# EasyEDA Pro project glimmer.epro, board Glimmer
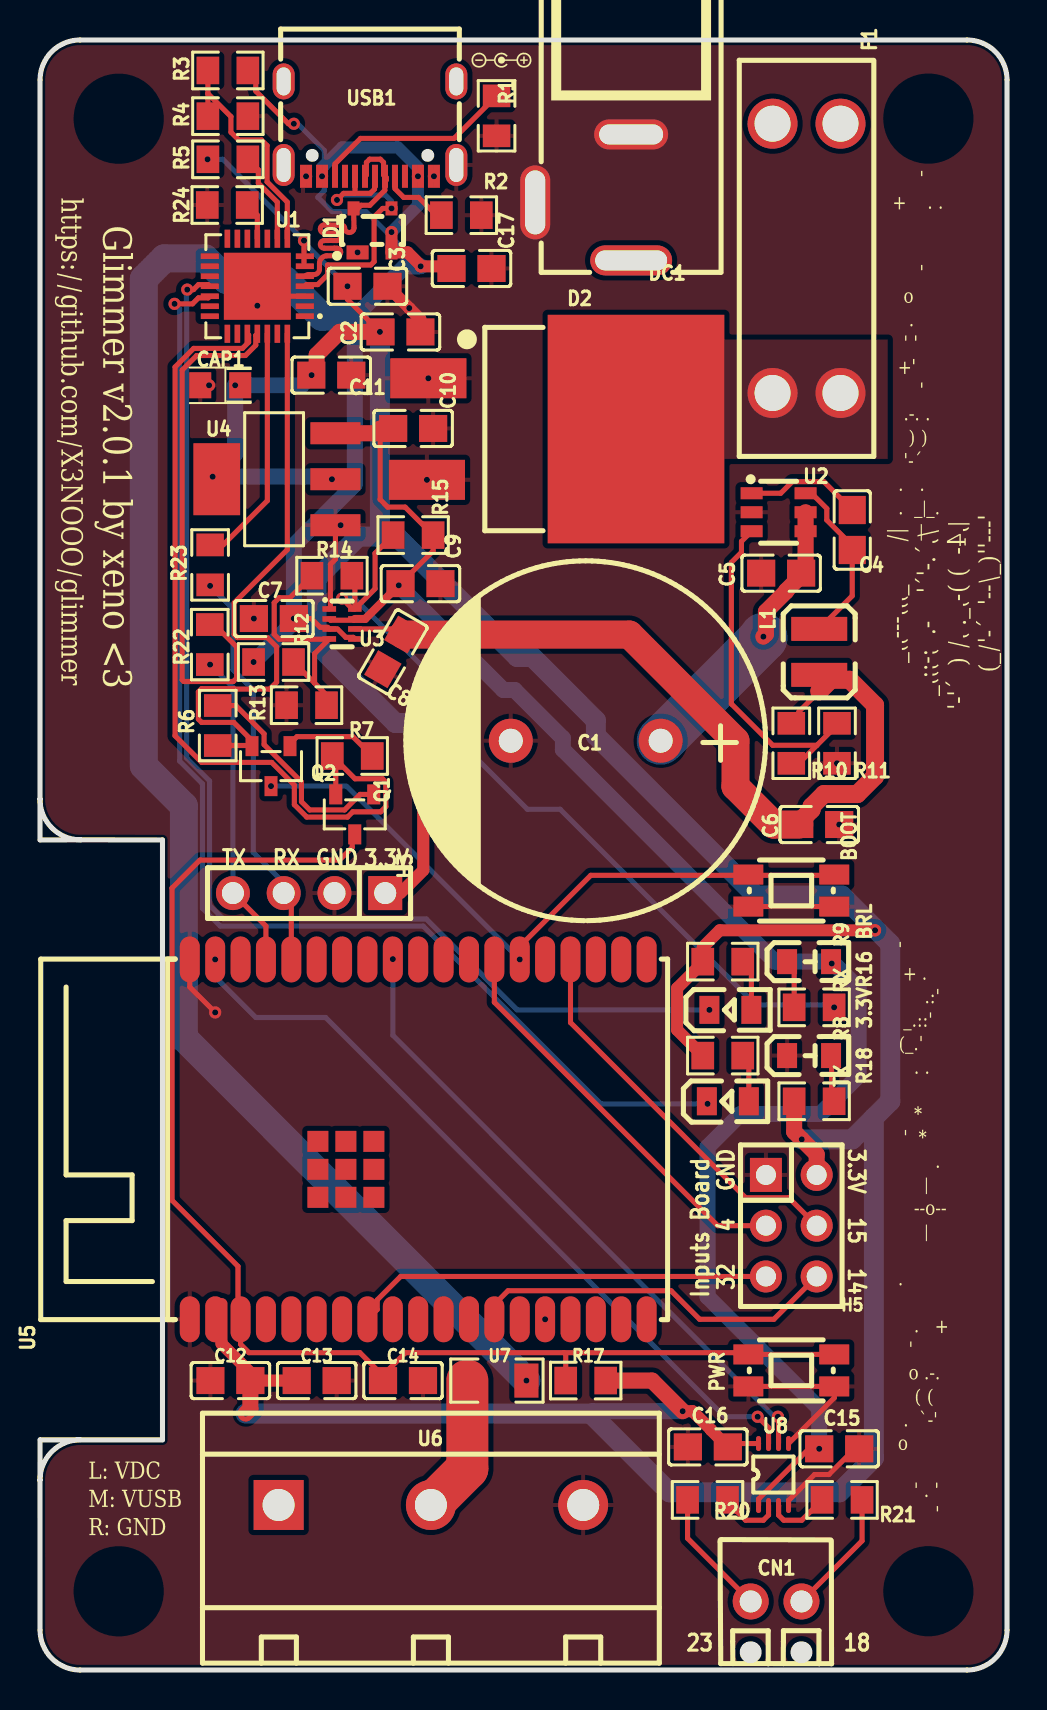
[diagram p4: board, top side]
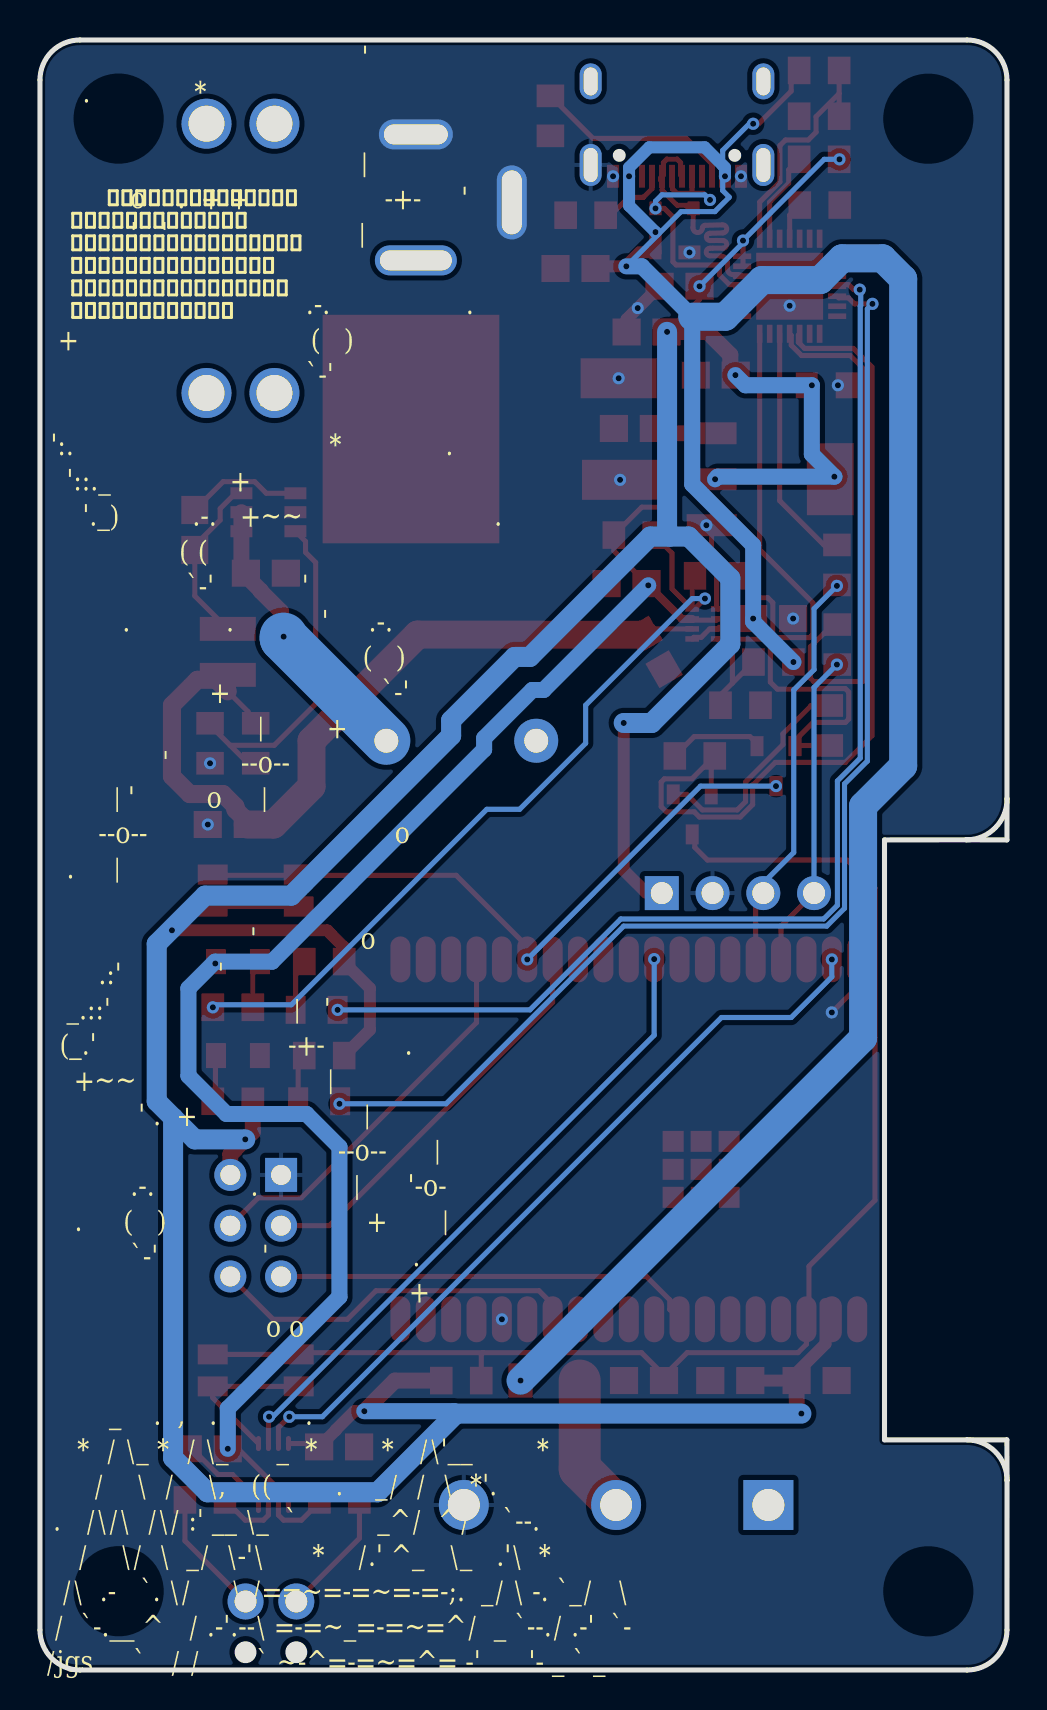
[diagram p5: board, bottom side, seen from below]

Outline 48.39 x 81.53 mm; copper layers: Top Layer, Inner1, Inner2, Bottom Layer. Coordinates in mm from the lower left corner of the outline.
Outline path: 0,9.49 0,2 arc(0.59,0.59) 2,0 46.39,0 arc(47.81,0.59) 48.39,2 48.39,79.53 arc(47.81,80.95) 46.39,81.53 2,81.53 arc(0.59,80.95) 0,79.53 0,43.56 ; 0,9.49 arc(0.59,10.92) 2.02,11.51 ; 0,9.49 0.01,11.51 6.13,11.51 6.13,41.52 2.05,41.53 0,41.52 0,43.58 arc(0.58,42.14) 2.01,41.52
Stack: Top Layer 0.035mm Outer layer thickness 1oz / Dielectric1 0.2104mm 7628 RC49% 8.6mil / Inner1 0.0152mm Inner layer thickness / Dielectric2 1.065mm 1.1mm H/HOZ Copper / Inner2 0.0152mm Inner layer thickness / Dielectric3 0.2104mm 7628 RC49% 8.6mil / Bottom Layer 0.035mm Outer layer thickness 1oz

## Design rules (mm)
net USB_D-: DP1
net USB_D+: DP1
template: JLCPCB Capability(Two Layers Board)
spacing copperThickness1oz (default): track to track 0.102, other pairs 0.152 to 0.3
spacing copperThickness2oz: track to track 0.203, other pairs 0.152 to 0.3
track width copperThickness1oz (default): min 0.127, default 0.254, max 2.54
track width copperThickness2oz: min 0.203, default 0.254, max 2.54
differential pair differentialPair (default): width min 0.127, default 0.254, max 2.54; gap min 0.152, default 0.152
via viaSize (default): diameter min 0.5, default 0.61, max 10; hole min 0.3, default 0.305, max 6.3

## Placement (name value [footprint] x y rotation side)
3.3V  NCD0805R1  [LED0805-RD]  38.49 30.73 0 top
BOOT  KMR241GLFS  [KEY-SMD_4P-L4.2-W2.8-P1.60-LS4.6]  37.6 38.99 180 top
BRL  NCD0805R1  [LED0805-RD]  38.49 35.43 0 top
C1  1000uF  [CAP-TH_BD18.0-P7.50-D1.2-FD]  27.31 46.48 180 top
C2  4.7uF  [C0805]  18.04 66.93 180 top
C3  100nF  [C0805]  16.39 69.21 180 top
C4  100nF  [C0805]  40.64 57.02 270 top
C5  2.2uF  [C0805]  37.09 54.86 0 top
C6  22uF  [C0805]  38.99 42.29 180 top
C7  1uF  [C0805]  11.7 52.59 0 top
C8  1uF  [C0805]  17.66 50.93 60 top
C9  10uF  [C0805]  19.04 54.34 180 top
C10  10uF  [C0805]  18.67 62.1 180 top
C11  22uF  [C0805]  14.58 64.77 180 top
C12  100nF  [C0805]  9.53 14.48 0 top
C13  22uF  [C0805]  13.85 14.48 180 top
C14  1uF  [C0805]  18.17 14.48 180 top
C15  100nF  [C0805]  39.99 11.06 0 top
C16  100nF  [C0805]  33.42 11.16 0 top
C17  10nF  [C0805]  21.59 70.1 180 top
CAP1  10uF  [CAP-SMD_L2.0-W1.3-FD]  9.02 64.26 180 top
CN1  1725656  [CONN-TH_2P-P2.54_1725656]  36.83 3.43 180 top
D1  SP0503BAHTG  [SOT-143_L2.9-W1.3-P1.92-LS2.3-BR]  16.64 72.01 270 top
D2  STPS40L45CG-TR  [TO-263-2_L10.0-W9.1-P5.08-LS15.2-BR]  24.59 62.07 180 top
DC1  DCJ200-10-A-K1-K  [DC-IN-TH_DCJ200-10-A-K1-K]  27.18 73.66 180 top
F1  3557-2  [FUSE-TH_4P-L19.8-W6.7_3557-2]  38.36 70.61 270 top
H3  PZ254V-11-04P  [HDR-TH_4P-P2.54-V-M]  13.47 38.86 180 top
H5  PM2.54-2*3  [HDR-TH_6P-P2.54-V-F-R2-C3-S2.54]  37.6 22.22 270 top
L1  15uH  [IND-SMD_L3.0-W3.0_FNR3010S]  38.99 50.93 270 top
PWR  KMR241GLFS  [KEY-SMD_4P-L4.2-W2.8-P1.60-LS4.6]  37.6 14.99 180 top
Q1  SS8050(RANGE:200-350)  [SOT-23-3_L2.9-W1.3-P1.90-LS2.4-BR]  15.75 42.8 90 top
Q2  SS8050(RANGE:200-350)  [SOT-23-3_L2.9-W1.3-P1.90-LS2.4-BR]  11.56 45.21 90 top
R1  5.1kΩ  [R0805]  22.85 77.74 90 top
R2  5.1kΩ  [R0805]  21.09 72.77 0 top
R3  22.1kΩ  [R0805]  9.4 80.01 180 top
R4  47.5kΩ  [R0805]  9.4 77.72 180 top
R5  1kΩ  [R0805]  9.4 75.56 0 top
R6  10kΩ  [R0805]  8.89 47.24 90 top
R7  10kΩ  [R0805]  15.62 45.72 0 top
R8  150Ω  [R0805]  34.17 30.73 180 top
R9  150Ω  [R0805]  34.17 35.43 180 top
R10  118K  [R0805]  37.6 46.35 90 top
R11  22.1kΩ  [R0805]  39.88 46.35 90 top
R12  27kΩ  [R0805]  11.69 50.42 0 top
R13  10kΩ  [R0805]  13.34 48.26 0 top
R14  1MΩ  [R0805]  14.61 54.74 0 top
R15  100kΩ  [R0805]  18.67 56.77 0 top
R16  300Ω  [R0805]  38.74 33.15 180 top
R17  10kΩ  [R0805]  27.31 14.48 180 top
R18  200Ω  [R0805]  38.74 28.45 0 top
R20  100Ω  [R0805]  33.41 8.51 0 top
R21  100Ω  [R0805]  40.14 8.51 180 top
R22  0Ω  [R0805]  8.5 51.29 270 top
R23  0Ω  [R0805]  8.51 55.28 270 top
R24  10kΩ  [R0805]  9.37 73.28 0 top
RX  KT-0805G  [LED0805-R-RD]  34.55 33.02 0 top
TX  KT-0805G  [LED0805-R-RD]  34.42 28.45 0 top
U1  CP2102N-A02-GQFN28R  [QFN-28_L5.0-W5.0-P0.50-TL-EP3.3]  10.88 69.22 180 top
U2  LMR54406DBVR  [SOT-23-6_L2.9-W1.6-P0.95-LS2.8-BR]  36.96 57.91 180 top
U3  TPS2116DRLR  [SOT-583-8_L2.1-W1.6-P0.50-LS1.6-BL]  15.12 52.32 270 top
U4  AMS1117-3.3  [SOT-223-3_L6.5-W3.4-P2.30-LS7.0-BR]  11.82 59.56 0 top
U5  2.4GHz  [WIFIM-SMD_39P-L31.4-W18.0-P1.27-1]  18.93 26.54 90 top
U6  DG636-7.62-03P-14-02A(H)  [CONN-TH_DG636-7.62-03P-14-02A-H]  19.56 8.25 0 top
U7  1206L075SLYR  [R1206]  22.86 14.48 180 top
U8  SN74LVC2T45DCUR  [VSSOP-8_L2.4-W2.1-P0.50-LS3.2-BR]  36.71 9.78 270 top
USB1  USB4105-GF-A  [TYPE-C-SMD_SBC-160S1A-20-S412]  16.51 77.09 180 top

## Footprints (pads in the part's own frame, mm; a bottom-side part is the same pattern mirrored in y, then rotated)
C0805
  rect 1.41x1.35 smd: 1(-1,0) 2(1,0)
CAP-SMD_L2.0-W1.3-FD
  rect 1.1x1.3 smd: 1(-1,0) 2(1,0)
CAP-TH_BD18.0-P7.50-D1.2-FD
  round 2.2 hole 1.2: 1(-3.75,0) 2(3.75,0)
CONN-TH_2P-P2.54_1725656
  round 1.8 hole 1.1: 1(-1.27,0) 2(1.27,0)
CONN-TH_DG636-7.62-03P-14-02A-H
  rect 2.5x2.5 hole 1.6: 1(-7.62,0)
  round 2.5 hole 1.6: 2(0,0) 3(7.62,0)
DC-IN-TH_DCJ200-10-A-K1-K
  oval 4.1x1.5 hole 3.6x1: 1(-2.4,3.15)
  oval 1.5x3.7 hole 1x3.2: 2(2.4,0.25)
  oval 3.7x1.5 hole 3.2x1: 3(-2.4,-3.15)
FUSE-TH_4P-L19.8-W6.7_3557-2
  round 2.5 hole 1.8: 1(-6.735,1.7) 2(-6.735,-1.7) 3(6.735,1.7) 4(6.735,-1.7)
HDR-TH_4P-P2.54-V-M
  rect 1.7x1.7 hole 1.1: 1(-3.81,0)
  round 1.7 hole 1.1: 2(-1.27,0) 3(1.27,0) 4(3.81,0)
HDR-TH_6P-P2.54-V-F-R2-C3-S2.54
  rect 1.7x1.6 hole 1: 1(-2.54,-1.27)
  round 1.6 hole 1: 2(-2.54,1.27) 3(0,-1.27) 4(0,1.27) 5(2.54,-1.27) 6(2.54,1.27)
IND-SMD_L3.0-W3.0_FNR3010S
  rect 1.2x2.8 smd: 1(-1.15,0) 2(1.15,0)
KEY-SMD_4P-L4.2-W2.8-P1.60-LS4.6
  rect 1.5x1 smd: 1(-2.15,0.8) 2(-2.15,-0.8) 3(2.15,0.8) 4(2.15,-0.8)
LED0805-R-RD
  rect 1x1.399 smd: 1(1.05,0) 2(-1.05,0)
LED0805-RD
  rect 1x1.25 smd: 1(-1.1,0) 2(1.1,0)
QFN-28_L5.0-W5.0-P0.50-TL-EP3.3
  rect 0.905x0.28 smd: 1(-2.377,1.5) 2(-2.377,1) 3(-2.377,0.5) 4(-2.377,0) 5(-2.377,-0.5) 6(-2.377,-1) 7(-2.377,-1.5) 15(2.377,-1.5) 16(2.377,-1) 17(2.377,-0.5) 18(2.377,0) 19(2.377,0.5) 20(2.377,1) 21(2.377,1.5)
  rect 0.28x0.905 smd: 8(-1.5,-2.377) 9(-1,-2.377) 10(-0.5,-2.377) 11(0,-2.377) 12(0.5,-2.377) 13(1,-2.377) 14(1.5,-2.377) 22(1.5,2.377) 23(1,2.377) 24(0.5,2.377) 25(0,2.377) 26(-0.5,2.377) 27(-1,2.377) 28(-1.5,2.377)
  rect 3.35x3.35 smd: 29(0,0)
R0805
  rect 1.133x1.377 smd: 1(-1,0) 2(1,0)
R1206
  rect 1.208x1.701 smd: 1(-1.479,0) 2(1.479,0)
SOT-23-3_L2.9-W1.3-P1.90-LS2.4-BR
  rect 1x0.65 smd: 1(1,-0.95) 2(1,0.95) 3(-1,0)
SOT-23-6_L2.9-W1.6-P0.95-LS2.8-BR
  rect 1.1x0.6 smd: 1(1.35,-0.95) 2(1.35,0) 3(1.35,0.95) 4(-1.35,0.95) 5(-1.35,0) 6(-1.35,-0.95)
SOT-143_L2.9-W1.3-P1.92-LS2.3-BR
  rect 0.7x1.1 smd: 1(1.1,-0.75)
  rect 0.7x0.6 smd: 2(1.1,0.95) 3(-1.1,0.95) 4(-1.1,-0.95)
SOT-223-3_L6.5-W3.4-P2.30-LS7.0-BR
  rect 2.5x1.1 smd: 1(2.97,-2.3) 2(2.97,0) 3(2.97,2.3)
  rect 2.34x3.6 smd: 4(-2.97,0)
SOT-583-8_L2.1-W1.6-P0.50-LS1.6-BL
  rect 0.28x0.68 smd: 1(-0.75,-0.64) 2(-0.25,-0.64) 3(0.25,-0.64) 4(0.75,-0.64) 5(0.75,0.64) 6(0.25,0.64) 7(-0.25,0.64) 8(-0.75,0.64)
TO-263-2_L10.0-W9.1-P5.08-LS15.2-BR
  rect 3.81x2 smd: 1(5.16,-2.54) 3(5.231,2.54)
  rect 8.84x11.43 smd: 4(-5.231,0)
TYPE-C-SMD_SBC-160S1A-20-S412
  oval 1.1x2.1 hole 0.7x1.7: 1(-4.32,1.807) 2(4.32,1.807)
  oval 1.1x1.8 hole 0.7x1.4: 3(4.32,-2.373) 4(-4.32,-2.373)
  rect 0.3x1.15 smd: A1(-3.35,2.372) A4(-2.55,2.372) A5(-1.25,2.372) A6(-0.25,2.372) A7(0.25,2.372) A8(1.25,2.373) A9(2.55,2.373) A12(3.35,2.372) B1(3.05,2.372) B4(2.25,2.373) B5(1.75,2.372) B6(0.75,2.372) B7(-0.75,2.372) B8(-1.75,2.373) B9(-2.25,2.372) B12(-3.05,2.372)
VSSOP-8_L2.4-W2.1-P0.50-LS3.2-BR
  oval 0.75x0.25 smd: 1(1.55,-0.75) 2(1.55,-0.25) 3(1.55,0.25) 4(1.55,0.75) 5(-1.55,0.75) 6(-1.55,0.25) 7(-1.55,-0.25) 8(-1.55,-0.75)
WIFIM-SMD_39P-L31.4-W18.0-P1.27-1
  oval 2.3x1 smd: 1(-9,11.43) 2(-9,10.16) 3(-9,8.89) 4(-9,7.62) 5(-9,6.35) 6(-9,5.08) 7(-9,3.81) 8(-9,2.54) 9(-9,1.27) 10(-9,0) 11(-9,-1.27) 12(-9,-2.54) 13(-9,-3.81) 14(-9,-5.08) 15(-9,-6.35) 16(-9,-7.62) 17(-9,-8.89) 18(-9,-10.16) 19(-9,-11.43) 20(9,-11.43) 21(9,-10.16) 22(9,-8.89) 23(9,-7.62) 24(9,-6.35) 25(9,-5.08) 26(9,-3.81) 27(9,-2.54) 28(9,-1.27) 29(9,0) 30(9,1.27) 31(9,2.54) 32(9,3.81) 33(9,5.08) 34(9,6.35) 35(9,7.62) 36(9,8.89) 37(9,10.16) 38(9,11.43)
  rect 1.05x1.05 smd: 39(-2.9,5.02) 39(-2.9,3.62) 39(-2.9,2.22) 39(-1.5,5.02) 39(-1.5,3.62) 39(-1.5,2.22) 39(-0.1,5.02) 39(-0.1,3.62) 39(-0.1,2.22)

## Nets
As in the schematic.

Pads without a net: U1 1 2 10 12 13 14 15 16 17 20 21 22 23 27; U5 4 5 6 7 9 10 11 12 14 16 17 18 19 20 21 22 27 28 29 31 32 33 36 39; USB1 2 3 4 A8 B8

## Via types
v1: diameter 0.61, hole 0.305, Top Layer to Bottom Layer, 55 vias

## Routing (per net, layer and track width the routed paths; a pad name or vN(x,y) marks a point on that pad's centre or on a via; arc(x,y) is an arc through that point)
3.3V: length 207.6
  Top Layer w0.254: v1(8.39,75.56) R5.1 ; U1.6 13.21,70.26 v1(13.21,71.5) ; v1(17.01,66.93) 15.39,68.56 v1(15.39,69.21) ; v1(14.61,59.56) 14.53,59.56 ; C16.2 34.59,11.33 U8.8
  Top Layer w0.6: v1(32.16,12.95) 32.65,12.95 33.58,12.02 33.58,12 C16.2 ; 18.04,38.86 19.18,40 v1(19.18,47.37) ; R8.2 31.88,32.02 31.88,34.1 33.17,35.39 R9.2 33.17,36.15 34.02,37 v1(41.79,37) ; C13.2 C12.2 10.53,14.88 9.09,16.32 9.09,18.3
  Top Layer w0.8: C12.2 10.53,13.06 v1(10.29,12.83) ; v1(32.16,12.95) 30.63,14.48 R17.1 ; v1(13.59,64.77) 13.85,65.02 13.85,65.79 15,66.93 v1(17.01,66.93) ; H5.2 38.87,25.8 v1(38.12,26.54) 37.74,26.92 R18.1
  Bottom Layer w0.254: v1(15.39,69.21) 13.21,71.39 v1(13.21,71.5) 9.15,75.56 v1(8.39,75.56)
  Bottom Layer w0.8: v1(14.61,59.56) 14.48,59.69 v1(8.64,59.69) 9.77,60.82 v1(9.77,64.26) 13.09,64.26 v1(13.59,64.77) ; 27.56,12.83 27.68,12.95 v1(32.16,12.95)
  Bottom Layer w1: 16.87,56.7 17.01,56.84 v1(17.01,66.93) ; 16.87,56.7 15.93,56.7 13.85,54.61 13.85,51.31 17.78,47.37 v1(19.18,47.37) ; 16.87,56.7 17.86,56.7 23.88,50.67 24.64,50.67 27.82,47.5 27.82,46.74 35.82,38.73 40.14,38.73 42.55,36.32 42.55,28.45 41.73,27.63 ; 41.73,27.63 40.64,26.54 v1(38.12,26.54) ; 41.73,27.63 41.73,10.61 40.01,8.89 31.5,8.89 27.56,12.83 v1(10.29,12.83)
5V_BARREL: length 42.5
  Top Layer w0.254: 37.98,47.35 37.98,47.94 38.99,48.95 ; U3.6 17.88,52.07 C8.2
  Top Layer w0.8: 39.03,48.99 39.03,49.74 L1.2
  Top Layer w0.9: C6.2 37.99,42.42 38.61,43.03 38.61,43.19 39.23,43.81 40.9,43.81 41.79,44.7 41.79,48.26 40.52,49.53 39.57,49.53 38.99,48.95
  Top Layer w1.4: C8.2 29.49,51.79 34.8,46.48 34.8,44.2 36.71,42.29 C6.2
+5V: length 84.3
  Top Layer w0.254: U3.7 15.69,52.51 14.54,52.51 U3.2 ; v1(38.99,11.06) 38.47,11.06 35.96,8.55 U8.1 ; 17.02,62.09 17.02,58.55 17.4,58.17 18.28,58.17 R15.2 19.67,55.97 C9.2
  Top Layer w0.4: C9.2 16.27,52.57 U3.7
  Top Layer w0.8: 17.04,62.1 16.8,61.86 14.15,61.86
  Bottom Layer w0.8: v1(38.99,11.06) 38.99,13.08 33.41,18.67 33.41,26.16 35.06,27.81 39.06,27.81 40.96,29.72 40.96,34.1 39.63,35.43 36.78,35.43 26.17,46.04 26.17,46.61 23.75,49.02 23.19,49.02 v1(17.95,54.26)
  vias: v1(39.62,35.34)
GND: length 30.6
  Top Layer w0.254: U5.38 7.5,34.16 v1(8.77,32.89) ; 35.45,14.19 39.75,14.19 39.75,13.62 U8.5 ; USB1.B12 USB1.A1 ; U4.1 14.79,55.56 14.53,55.31 14.53,53.13 U3.1 ; 13.26,68.72 11.38,68.72 U1.29 ; BOOT.3 BOOT.1 ; C15.2 40.77,11.06 39.48,9.78 38.76,9.78 37.46,8.48 U8.4
  Top Layer w0.6: C2.1 19.04,67.56 v1(18.48,68.12) C3.1
  vias: v1(8.46,64.26) v1(10.7,52.59) v1(10.88,68.24) v1(13.31,74.72) v1(15.05,57.26) v1(15.89,70.91) v1(19.36,59.53) v1(19.43,64.61) v1(19.71,74.72) v1(25.28,17.54) v1(39.88,45.35) v1(39.99,42.29)
(no net): length 0.1
  Top Layer w0.254: USB1.2 12.34,75.28
CP_RXT: length 59.7
  Top Layer w0.254: v1(7.37,69.05) 7.68,69.05 7.93,69.3 8.42,69.3 8.5,69.21
  Bottom Layer w0.254: v1(7.37,69.05) 7.32,69 7.32,68.25 7.35,68.23 7.35,45.61 8.49,44.47 8.49,38.25 9.17,37.57 19.33,37.57 23.88,33.02 v1(33.5,33.02)
CP_TXT: length 62.1
  Top Layer w0.254: v1(6.74,68.34) 7.63,68.34 7.93,68.63 8.42,68.63 8.5,68.72
  Bottom Layer w0.254: v1(6.74,68.34) 6.99,68.08 6.99,45.47 8.13,44.32 8.13,38.1 9.02,37.21 19.18,37.21 28.07,28.32 v1(33.41,28.32)
CP_VBUS: length 11.9
  Top Layer w0.254: 8.4,78.85 9.56,77.7 9.56,76.92 9.94,76.53 11.08,76.53 11.37,76.25 11.37,74.44 12.38,73.43 U1.8 ; 8.4,78.85 R3.2 ; 8.4,78.85 R4.2
DATA_1_IN: length 38.7
  Top Layer w0.254: U8.7 36.46,12.12 v1(35.91,12.67)
  Bottom Layer w0.254: v1(8.77,35.54) 8.77,34.67 10.8,32.64 14.29,32.64 34.26,12.67 v1(35.91,12.67)
DATA_1_OUT: length 5.8
  Top Layer w0.254: CN1.2 32.41,6.59 32.41,7.87
DATA_2_IN: length 32.3
  Top Layer w0.254: U8.6 36.96,12.64 v1(36.93,12.67)
  Bottom Layer w0.254: v1(17.66,35.56) 17.66,31.75 36.74,12.67 v1(36.93,12.67)
DATA_2_OUT: length 5.7
  Top Layer w0.254: CN1.1 41.14,6.46 41.14,7.87
DTR: length 30.9
  Top Layer w0.254: 10.61,46.34 10.52,46.24 R6.1 ; 10.61,46.34 10.61,46.49 9.7,47.4 8.09,47.4 7.93,47.56 7.93,48.93 8.09,49.09 9.7,49.09 9.72,49.06 11.49,49.06 11.84,49.41 11.84,51.18 11.38,51.64 9.88,51.64 9.72,51.8 9.72,53.38 12.38,56.04 U1.28 ; 10.61,46.34 Q2.2
ESP32_BOOT: length 33.9
  Top Layer w0.254: BOOT.2 39.71,39.75 27.56,39.75 24.01,36.19 v1(24.01,35.54)
  Bottom Layer w0.254: v1(11.56,44.21) 15.34,44.21 v1(24.01,35.54)
ESP32_EN: length 67.2
  Top Layer w0.254: C14.2 17.17,14.72 ; 17.17,14.72 16.01,15.88 10.46,15.88 10.04,16.29 U5.3 9.91,17.67 9.91,20.19 6.61,23.49 6.61,39.12 8.01,40.51 14.99,40.51 15.62,41.15 15.62,41.67 Q1.3 ; 17.17,14.72 17.17,14.75 18.29,15.88 26.22,15.88 ; 26.22,15.88 26.31,15.79 R17.2 ; 26.22,15.88 35.36,15.88 ; PWR.4 PWR.2
ESP32_RXD0: length 20.6
  Top Layer w0.254: v1(8.51,54.23) R23.2 ; U5.34 12.58,38.48 H3.3
  Bottom Layer w0.254: 12.7,38.86 10.67,40.89 10.67,49.02 9.66,50.04 9.66,53.09 v1(8.51,54.23)
ESP32_TXD0: length 15.9
  Top Layer w0.254: H3.4 11.31,37.21 U5.35 ; v1(8.51,50.29) R22.2
  Bottom Layer w0.254: H3.4 9.66,49.15 v1(8.51,50.29)
GPIO4: length 20.4
  Top Layer w0.254: H5.3 33.91,22.22 22.74,33.4 U5.26
GPIO14: length 18.6
  Top Layer w0.254: U5.13 22.74,18.29 23.42,18.97 31.58,18.97 33.01,17.54 36.72,17.54 H5.6
GPIO15: length 19.7
  Top Layer w0.254: U5.23 26.55,32.38 35.31,23.62 37.47,23.62 H5.4
GPIO32: length 21.1
  Top Layer w0.254: 16.39,17.54 16.88,18.03 16.88,18.52 18.05,19.68 H5.5
RTS: length 42.3
  Top Layer w0.254: 14.8,45.54 R7.1 ; 14.8,45.54 15.77,44.58 17.14,44.58 17.31,44.41 17.31,43.18 17.05,42.93 15.65,42.93 15.39,42.66 13.35,42.66 12.73,43.29 12.73,44.26 11.59,45.4 8.09,45.4 6.76,46.73 6.76,65.18 7.69,66.11 10.13,66.11 10.44,66.42 10.44,66.77 U1.24 ; 14.8,45.54 Q1.2
TPS_ST: length 41.3
  Top Layer w0.254: U3.8 15.76,54.59 R14.2 ; U3.8 16.77,54.08 16.77,55.86 R15.1 ; U3.8 15.64,53.07 v1(15.12,53.59)
  Bottom Layer w0.254: v1(15.12,53.59) 15.75,53.59 21.09,48.26 21.09,46.35 24.39,43.05 26.03,43.05 35.81,33.27 39.61,33.27 v1(39.74,33.15)
USB_D+: length 14.5
  Top Layer w0.254: USB1.B6 15.76,73.9 15.73,73.86 16.53,73.86 16.74,74.07 16.74,74.69 USB1.A6 ; 15.73,73.86 15.19,73.86 v1(14.86,73.53) ; U1.4 13.34,69.3 13.9,69.3 14.39,69.79 14.39,70.28 16.56,70.28 16.72,70.44 16.72,72.68 17.15,73.11 v1(17.59,73.11)
  Bottom Layer w0.254: v1(14.86,73.53) 14.87,73.53 15.12,73.79 17.27,73.79 17.59,73.47 v1(17.59,73.11)
USB_D-: length 14.6
  Top Layer w0.254: 13.99,70.36 13.99,70.08 arc(13.9,69.88) 13.71,69.8 13.45,69.8 arc(13.34,69.78) 13.26,69.72 ; USB1.A7 16.34,74.79 16.34,75.41 16.5,75.57 17.03,75.57 17.19,75.41 17.19,74.79 USB1.B7 17.33,74.65 17.33,74.53 17.26,74.46 17.26,74.02 16.51,73.27 16.07,73.27 15.85,73.05 15.75,73.05 15.69,73.11 15.72,72.15 arc(15.49,71.91) 15.24,72.14 arc(15.21,72.22) 15.12,72.26 14.24,72.29 arc(14.03,72.09) 14.23,71.88 14.87,71.87 arc(15.05,71.68) 14.86,71.5 arc(14.55,71.51) 14.23,71.5 14.22,71.5 arc(14.03,71.31) 14.23,71.12 arc(14.48,71.12) 14.74,71.12 14.87,71.12 arc(15.06,70.92) 14.86,70.74 arc(14.61,70.74) 14.36,70.74 arc(14.09,70.62) 13.99,70.36
USB_VBUS: length 131
  Top Layer w0.254: v1(12.7,52.59) 13.58,52.59 14.02,52.16 14.4,52.16 U3.3 14.88,52.07 15.3,51.66 15.68,51.66 U3.5 ; v1(12.7,77.34) 12.43,77.34 10.8,78.98 10.8,79.61 R3.1
  Top Layer w0.6: C17.2 20.49,70.21 v1(19.05,70.21) 19.05,70.26 18.4,70.91 D1.2 v1(17.59,71.92)
  Bottom Layer w0.254: v1(12.7,77.34) 12.9,77.34 14.23,76.01 14.23,75.27 ; v1(19.05,70.21) 16.31,72.95 14.62,72.95 13.91,73.66 13.91,73.68 14.23,74 14.23,74.72
  Bottom Layer w0.6: v1(14.11,74.72) 14.11,75.15 15.13,76.17 17.9,76.17 18.91,75.15 18.91,73.25 v1(17.59,71.92)
  Bottom Layer w0.8: v1(19.05,70.21) 18.27,70.21 15.75,67.69 15.75,59.31 12.7,56.26 v1(12.7,52.59) 12.7,52.43 v1(10.69,50.42)
  Bottom Layer w1.4: v1(24.34,14.48) 7.2,31.62 7.2,43.22 5.2,45.23 5.2,69.58 6.23,70.61 8.26,70.61 9.35,69.53 12.27,69.53 14.1,67.69 15.75,67.69
  vias: v1(18.91,74.72)
VDC: length 14.4
  Top Layer w0.8: v1(36.2,51.69) 36.33,51.82 36.33,52.94 37.35,53.96 37.35,53.99 38.09,54.74 C5.2 38.31,55.09 U2.4 U2.5
  Bottom Layer w2.4: v1(36.2,51.69) 36.2,51.62 C1.1
$1N1267: length 10.1
  Top Layer w0.254: R1.2 20.72,76.61 16.04,76.61 14.76,75.33 USB1.B5
$1N1268: length 3.2
  Top Layer w0.254: USB1.A5 17.76,74.1 18.2,73.66 18.94,73.66 19.83,72.77
$1N2130: length 4.6
  Top Layer w0.254: R5.2 10.93,75.04 10.93,74.37 11.88,73.42 U1.9
$1N2140: length 4.7
  Top Layer w0.254: R7.2 15.66,46.69 12.86,46.69 12.51,46.34
$1N2141: length 11.2
  Top Layer w0.254: Q1.1 16.02,43.8 15.24,43.02 13.5,43.02 13.09,43.43 13.09,44.42 11.22,46.29 11.22,46.83 9.8,48.24 R6.2
$1N2159: length 12
  Top Layer w0.254: U1.26 11.38,58.49 9.16,56.28 8.64,56.28
$1N2160: length 26.4
  Top Layer w0.254: U1.25 10.8,66.76 10.8,66.27 10.28,65.75 7.84,65.75 7.12,65.02 7.12,49.53 7.2,49.45 9.67,49.45 9.84,49.61 9.84,51.18 8.73,52.29 8.62,52.29
$1N2165: length 1.9
  Top Layer w0.254: R24.2 10.88,72.77 U1.11
$1N3037: length 17
  Top Layer w0.254: U2.3 35.1,56.45 35.1,55.91 34.6,55.4 34.6,48.32 36.67,46.26 38.88,46.26 ; R11.2 39.88,47.26 38.88,46.26 ; 38.88,46.26 37.98,45.35
$1N3040: length 8.6
  Top Layer w0.254: L1.1 40.64,53.73 C4.2 40.64,56.25 39.37,57.52 39.37,58.09 38.61,58.86 U2.6
$1N3041: length 5.9
  Top Layer w0.254: U2.1 37.07,58.86 37.65,59.44 39.23,59.44 C4.1
$1N3045: length 12.2
  Top Layer w0.254: 13.74,49.36 14.34,48.77 R13.2 ; 13.74,49.36 R12.2 ; 13.74,49.36 13.74,50.84 14.47,51.56 ; 14.47,51.56 11.96,51.56 11.72,51.8 11.72,53.38 11.97,53.64 12.51,53.64 R14.1 ; 14.47,51.56 U3.4
$1N3047: length 2.4
  Top Layer w0.254: R16.2 37.74,35.08 BRL.1
$1N3995: length 2.3
  Top Layer w0.254: 39.61,28.45 39.61,30.71 3.3V.2
$1N4000: length 7
  Top Layer w2.1: 21.39,14.48 21.39,10.08 U6.2
$1N4313: length 3.1
  Top Layer w0.254: R20.2 34.41,8.4 35.31,7.49 36.2,7.49 36.46,7.75 U8.2
$1N4314: length 3.2
  Top Layer w0.254: R21.2 38.12,7.49 37.22,7.49 36.96,7.75 36.96,8.22 U8.3
$1N4682: length 2.6
  Top Layer w0.254: RX.1 35.6,35 R9.1
$1N4683: length 2.4
  Top Layer w0.254: TX.1 35.47,30.43 R8.1

## Copper pours and planes (outline as drawn; the poured copper is in the pictures)
GND on Top Layer: -8,85.34 55.25,85.34 55.25,-1.78 -8,-1.78
GND on Bottom Layer: -7.49,85.34 57.66,85.34 57.66,-2.92 -7.49,-2.92
GND on Inner1: -4.19,86.61 51.19,86.61 51.19,-5.59 -4.19,-5.59
VDC on Top Layer: 34.17,66.55 42.42,66.55 42.42,60.58 34.17,60.58
VDC on Top Layer: 25.76,67.43 34.04,67.43 34.04,56.64 25.76,56.64
VDC on Inner2: -0.63,82.68 22.22,82.68 22.22,68.07 49.53,68.07 49.53,-0.51 -0.63,-0.51
$1N1261 on Inner2: 23.37,83.44 53.73,83.44 53.73,69.09 23.37,69.09

## Text on the board
Bottom Silkscreen Layer: ⣤⠤⣄⠀⠀⠀⠀⠀⠀⠀⠀⠀⠀⠀ / ⠀⠀⠀⢰⡇⠀⠹⢦⡤⢤⣄⡀⠀ / ⢠⡴⠞⠋⠀⠀⠀⠀⠀⢀⡾⠀⠀⠀⠀⠀⠀ / ⠘⢧⣄⡀⠀⠀⠀⠀⠀⢻⡀⠀⠀⠀⠀ / ⠀⠀⠈⣿⠀⠀⢀⣀⣀⣀⣱⠀⠀⠀⠀⠀ / ⠀⠀⠀⢿⣤⠶⠋⠀⠈⠉⠁⠀ | _    .  ,   .           . / *  / \_ *  / \_      _  *        *   /\'__        * / /    \  /    \,   ((        .    _/  /  \  *'. / .   /\/\  /\/ :' __ \_  `          _^/  ^/    `--. / /    \/  \  _/  \-'\      *    /.' ^_   \_   .'\  * / /\  .-   `. \/     \ /==~=-=~=-=-;.  _/ \ -. `_/   \ / /  `-.__ ^   / .-'.--\ =-=~_=-=~=^/  _ `--./ .-'  `- / /jgs     `.  / /       `.~-^=-=~=^=.-'      '-._ `._ | ' / .             * / | / o    .  + +                 -+-     ' / '   '                        | / .-.                 . / +                             (   ) / `-' / ' / ':.                                *             . / '::._               + / '._)         .-.   +~~                        . / ( ( / `-'           ' / .            .           '     .-. / (   ) / +                   `-' / |        + / '         --o-- / | '         o     | / --o--                               o / .     | / '             o / .:'            ' / _.::'                       |   ' / (_.'                        -+-          . / +~~                        | / ' .  +                     | / --o--      | / .-.            .            |      '-o- / .     (   )                         +       | / `-'             '                  . / + / o o
Top Silkscreen Layer: TX | RX | GND | 3.3V | 23 | 18 | 4 | 32 | 15 | 14 | Inputs Board | ' / +    . . / ' / o / . / ' ' / +' / ' / .-. . / ) ) / '-´ / .   . / .  _|_. / | | ' / + . / .:' / _.::' / (_.' / . . / * / '  * / . / | / --o-- / | / . / .   + / ' / o .-. / ( ( / .  `-' / o / ' . ' / .     ' | L: VDC / M: VUSB / R: GND | |\      _,,,---,,_ / /,`.-'`'    -.  ;-;;,_ / |,4-  ) )-,_. ,\ (  `'-' / '---''(_/--'  `-'\_) | https://github.com/X3NOOO/glimmer | Glimmer v2.0.1 by xeno <3
